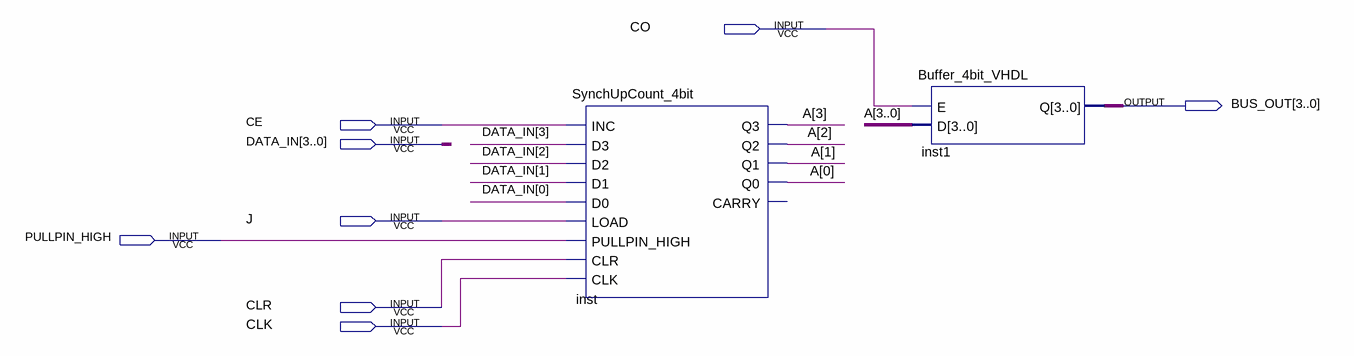
[diagram p0: schematic sheet]
// Quartus schematic PC_4bit.bdf as structural Verilog: 2 symbols, 8 pins
module PC_4bit (
  input  CO,
  input  CE,
  input  [3:0] DATA_IN,
  input  J,
  input  PULLPIN_HIGH,
  input  CLR,
  input  CLK,
  output [3:0] BUS_OUT
);

  wire [3:0] A;

  SynchUpCount_4bit inst (
    .INC(CE), .D3(DATA_IN[3]), .D2(DATA_IN[2]), .D1(DATA_IN[1]), .D0(DATA_IN[0]), .LOAD(J),
    .PULLPIN_HIGH(PULLPIN_HIGH), .CLR(CLR), .CLK(CLK), .Q3(A[3]), .Q2(A[2]), .Q1(A[1]), .Q0(A[0]));  // open: CARRY
  Buffer_4bit_VHDL inst1 (.E(CO), .D(A), .Q(BUS_OUT));
endmodule
